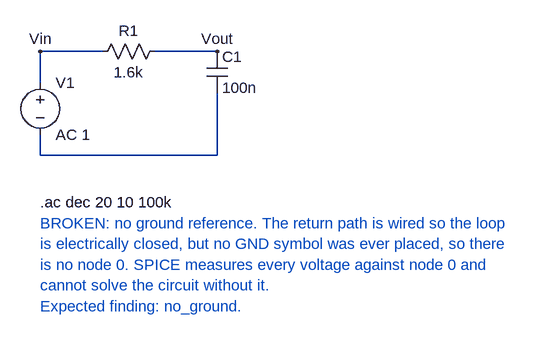
[diagram p0: schematic missing_ground.asc]
missing_ground.asc, the LTspice schematic file:
Version 4.1
SHEET 1 880 680
WIRE 0 -32 96 -32
WIRE 176 -32 272 -32
WIRE 0 16 0 -32
WIRE 0 128 0 96
WIRE 272 32 272 128
WIRE 0 128 272 128
FLAG 0 -32 Vin
FLAG 272 -32 Vout
SYMBOL voltage 0 0 R0
WINDOW 123 24 124 Left 2
WINDOW 39 0 0 Left 0
SYMATTR InstName V1
SYMATTR Value AC 1
SYMBOL res 192 -48 R90
WINDOW 0 0 56 VBottom 2
WINDOW 3 32 56 VTop 2
SYMATTR InstName R1
SYMATTR Value 1.6k
SYMBOL cap 256 -32 R0
SYMATTR InstName C1
SYMATTR Value 100n
TEXT 0 200 Left 2 !.ac dec 20 10 100k
TEXT 0 232 Left 2 ;BROKEN: no ground reference. The return path is wired so the loop
TEXT 0 264 Left 2 ;is electrically closed, but no GND symbol was ever placed, so there
TEXT 0 296 Left 2 ;is no node 0. SPICE measures every voltage against node 0 and
TEXT 0 328 Left 2 ;cannot solve the circuit without it.
TEXT 0 360 Left 2 ;Expected finding: no_ground.

The netlist it stands for:
* missing_ground.asc
V1 Vin N001 AC 1
R1 Vout Vin 1.6k
C1 Vout N001 100n
.ac dec 20 10 100k
* BROKEN: no ground reference. The return path is wired so the loop
* is electrically closed, but no GND symbol was ever placed, so there
* is no node 0. SPICE measures every voltage against node 0 and
* cannot solve the circuit without it.
* Expected finding: no_ground.
.backanno
.end